# Altium schematic sheet audio.SchDoc: 音频功放
size A4; Author: Todd; DrawnBy: 1234; SheetNumber: 1
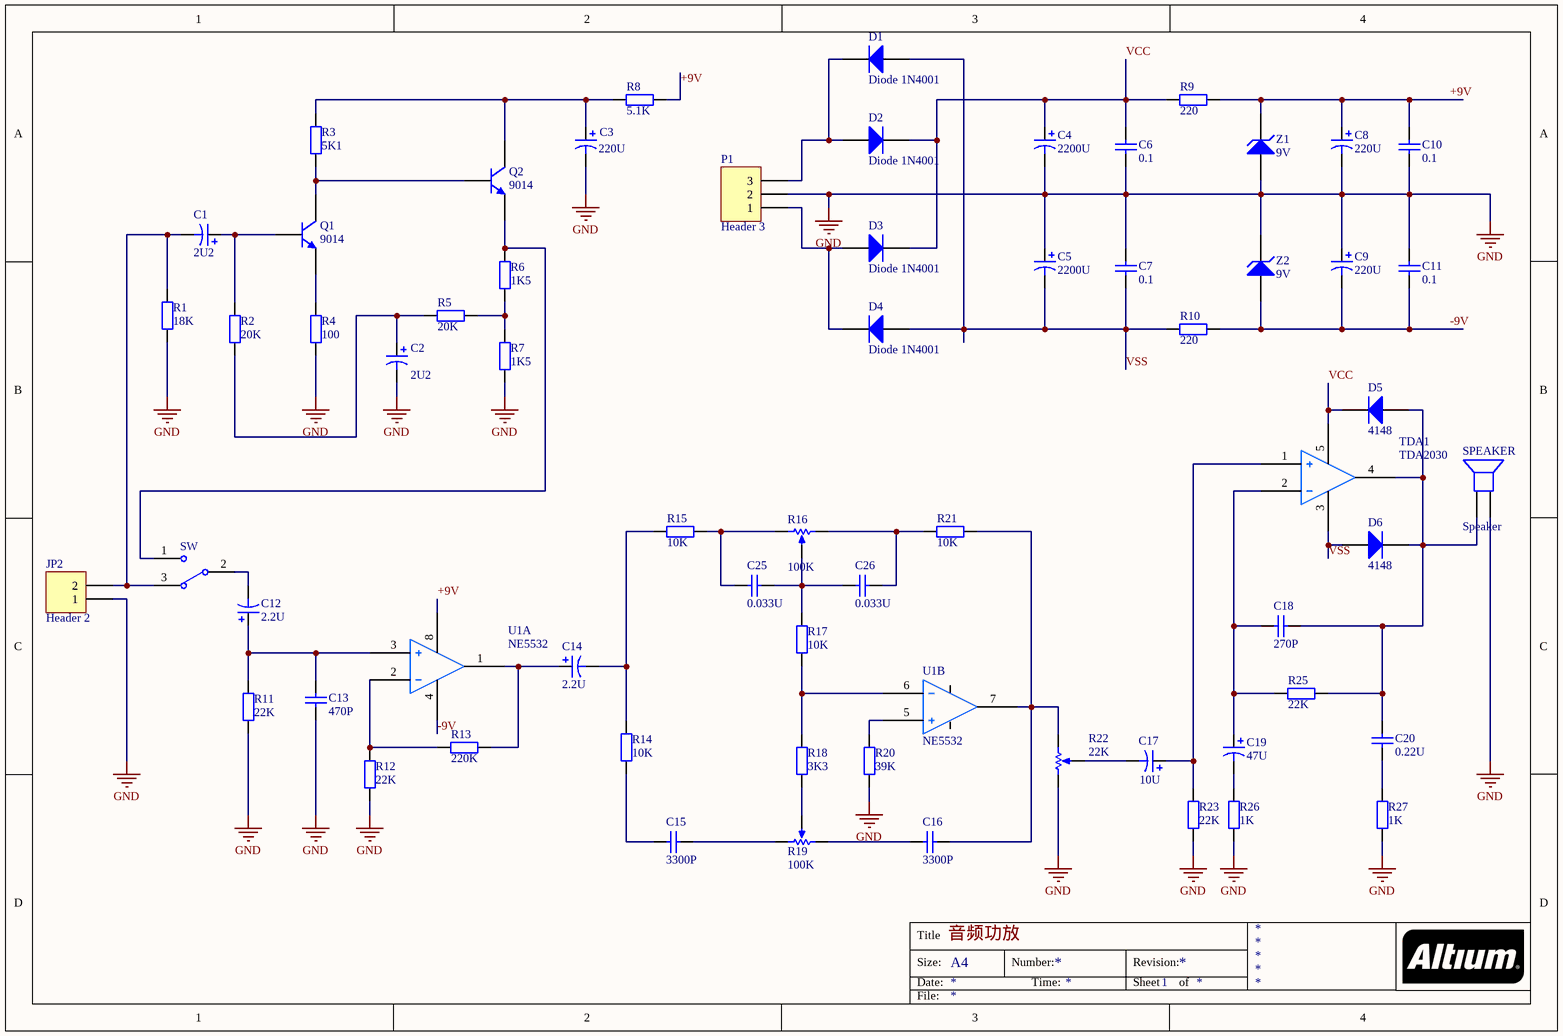
[diagram p0: audio.SchDoc]

## Parts
C1  2U2  [CD0.2]
C2  2U2  [CD0.2]
C3  220U  [CD0.2]
C4  2200U  [CD0.2]
C5  2200U  [CD0.2]
C6  0.1  [C0.2A]
C7  0.1  [C0.2A]
C8  220U  [CD0.2]
C9  220U  [CD0.2]
C10  0.1  [C0.2A]
C11  0.1  [C0.2A]
C12  2.2U  [CD0.2]
C13  470P  [C0.2A]
C14  2.2U  [CD0.2]
C15  3300P  [C0.2A]
C16  3300P  [C0.2A]
C17  10U  [CD0.2]
C18  270P  [C0.2A]
C19  47U  [CD0.2]
C20  0.22U  [C0.2A]
C25  0.033U  [C0.2A]
C26  0.033U  [C0.2A]
D1  Diode 1N4001  [DIODE0.4]
D2  Diode 1N4001  [DIODE0.4]
D3  Diode 1N4001  [DIODE0.4]
D4  Diode 1N4001  [DIODE0.4]
D5  4148  [DIODE0.4]
D6  4148  [DIODE0.4]
JP2  Header 2  [p2]
P1  Header 3  [p3]
Q1  9014  [TO-226-AA]
Q2  9014  [TO-226-AA]
R1  18K  [AXIAL-0.4]
R2  20K  [AXIAL-0.4]
R3  5K1  [AXIAL-0.4]
R4  100  [AXIAL-0.4]
R5  20K  [AXIAL-0.4]
R6  1K5  [AXIAL-0.4]
R7  1K5  [AXIAL-0.4]
R8  5.1K  [AXIAL-0.4]
R9  220  [AXIAL-0.4]
R10  220  [AXIAL-0.4]
R11  22K  [AXIAL-0.4]
R12  22K  [AXIAL-0.4]
R13  220K  [AXIAL-0.4]
R14  10K  [AXIAL-0.4]
R15  10K  [AXIAL-0.4]
R16  100K  [LK01]
R17  10K  [AXIAL-0.4]
R18  3K3  [AXIAL-0.4]
R19  100K  [LK01]
R20  39K  [AXIAL-0.4]
R21  10K  [AXIAL-0.4]
R22  22K  [LK01]
R23  22K  [AXIAL-0.4]
R25  22K  [AXIAL-0.4]
R26  1K  [AXIAL-0.4]
R27  1K  [AXIAL-0.4]
SPEAKER  Speaker  [p2]
SW  SW-SPDT  [SW]  (value not drawn)
TDA1  TDA2030  [7805E]
U1  NE5532  [DIP8]  (parts A,B of 2)
Z1  9V  [DIODE0.4]
Z2  9V  [DIODE0.4]

## Nets
GND: C2.2 C3.2 C4.2 C5.1 C6.1 C7.2 C8.2 C9.1 C10.2 C11.1 C13.1 JP2.1 P1.2 R1.1 R4.1 R7.1 R11.1 R12.1 R20.1 R22.1(TOP) R23.1 R26.1 R27.1 SPEAKER.2 Z1.1(A) Z2.2(K)
+9V: C8.1 C10.1 R8.2 R9.2 U1.8 Z1.2(K)
-9V: C9.2 C11.2 R10.2 U1.4 Z2.1(A)
VCC: C4.1 C6.2 D2.2(K) D3.2(K) D5.2(K) R9.1 TDA1.5
VSS: C5.2 C7.1 D1.1(A) D4.1(A) D6.1(A) R10.1 TDA1.3
NetC1_1: C1.1 Q1.2(B) R2.2
NetC1_2: C1.2 JP2.2 R1.2 SW.3
NetC2_1: C2.1 R2.1 R5.1
NetC3_1: C3.1 Q2.3(C) R3.2 R8.1
NetC12_1: C12.1 C13.2 R11.2 U1.3
NetC12_2: C12.2 SW.2
NetC14_1: C14.1 R13.2 U1.1
NetC14_2: C14.2 R14.2 R15.1
NetC15_1: C15.1 R14.1
NetC15_2: C15.2 R19.2(BOT)
NetC16_1: C16.1 R19.1(TOP)
NetC16_2: C16.2 R21.2 R22.2(BOT) U1.7
NetC17_1: C17.1 R23.2 TDA1.1
NetC17_2: C17.2 R22.3(TAP)
NetC18_1: C18.1 C19.1 R25.1 TDA1.2
NetC18_2: C18.2 C20.2 D5.1(A) D6.2(K) R25.2 SPEAKER.1 TDA1.4
NetC19_2: C19.2 R26.2
NetC20_1: C20.1 R27.2
NetC25_1: C25.1 R15.2 R16.1(TOP)
NetC25_2: C25.2 C26.1 R16.3(TAP) R17.2
NetC26_2: C26.2 R16.2(BOT) R21.1
NetD1_2: D1.2(K) D2.1(A) P1.3
NetD3_1: D3.1(A) D4.2(K) P1.1
NetQ1_1: Q1.1(E) R4.2
NetQ1_3: Q1.3(C) Q2.2(B) R3.1
NetQ2_1: Q2.1(E) R6.2 SW.1
NetR5_2: R5.2 R6.1 R7.2
NetR12_2: R12.2 R13.1 U1.2
NetR17_1: R17.1 R18.2 U1.6
NetR18_1: R18.1 R19.3(TAP)
NetR20_2: R20.2 U1.5

## Notes on the sheet
- Title
- Size:
- Date:
- A4
- Number:
- Time:
- Revision:
- Sheet
- of
- File:

## Library data of the parts
C1-C5 C8 C9 C12 C14 C17 C19 = Cap Pol1: Polarized Capacitor (Radial); Published: 8-Jun-2000; LatestRevisionDate: 17-Jul-2002; LatestRevisionNote: Re-released for DXP Platform.; PackageReference: RB7.6-15; Publisher: Altium Limited
C6 C7 C10 C11 C13 C15 C16 C18 C20 C25 C26 = Cap: Capacitor; Published: 8-Jun-2000; LatestRevisionDate: 17-Jul-2002; LatestRevisionNote: Re-released for DXP Platform.; PackageReference: RAD-0.3; Publisher: Altium Limited
D1-D4 = Diode 1N4001: 1 Amp General Purpose Rectifier; Published: 8-Jun-2000; LatestRevisionDate: 17-Jul-2002; LatestRevisionNote: Re-released for DXP Platform.; DatasheetVersion: 1998; PackageVersion: Aug-1999; PackageReference: DO-41; Publisher: Altium Limited; Code_JEDEC: DO-204-AL; ComponentLink1Description: Manufacturer Link; ComponentLink1URL: http://www.fairchildsemi.com/; ComponentLink2Description: Datasheet; ComponentLink2URL: http://www.fairchildsemi.com/ds/1N%2F1N4001.pdf
D5 D6 = Diode 1N4148: High Conductance Fast Diode; Published: 8-Jun-2000; LatestRevisionDate: 17-Jul-2002; LatestRevisionNote: Re-released for DXP Platform.; DatasheetVersion: 1997; PackageReference: DO-35; Publisher: Altium Limited; Code_JEDEC: DO-204-AH; ComponentLink1Description: Manufacturer Link; ComponentLink1URL: http://www.fairchildsemi.com/; ComponentLink2Description: Datasheet; ComponentLink2URL: http://www.fairchildsemi.com/ds/1N%2F1N4148.pdf
JP2 = Header 2: Header, 2-Pin; LatestRevisionDate: 17-Jul-2002; LatestRevisionNote: Re-released for DXP Platform.; Publisher: Altium Limited
P1 = Header 3: Header, 3-Pin; LatestRevisionDate: 17-Jul-2002; LatestRevisionNote: Re-released for DXP Platform.; Publisher: Altium Limited
Q1 Q2 = 2N3904: NPN General Purpose Amplifier; Published: 8-Jun-2000; LatestRevisionDate: 15-Jan-2003; LatestRevisionNote: PCB Footprint 'BCY-W3/D4.7' replaced; DatasheetVersion: 1997; PackageVersion: Sep-1998; PackageReference: TO-92A; Publisher: Altium Limited; Code_JEDEC: TO-92A; ComponentLink1Description: Manufacturer Link; ComponentLink1URL: http://www.fairchildsemi.com/; ComponentLink2Description: Datasheet; ComponentLink2URL: http://www.fairchildsemi.com/ds/2N%2F2N3904.pdf
R1-R15 R17 R18 R20 R21 R23 R25-R27 = Res2: Resistor; Published: 8-Jun-2000; LatestRevisionDate: 17-Jul-2002; LatestRevisionNote: Re-released for DXP Platform.; PackageReference: AXIAL-0.4; Publisher: Altium Limited
R16 R19 R22 = RPot: Potentiometer; Sim Note: Enter the Resistance value and the set point into parameter fields.; Set Position: 0.5; Published: 8-Jun-2000; LatestRevisionDate: 17-Jul-2002; LatestRevisionNote: Re-released for DXP Platform.; PackageReference: VR5; Publisher: Altium Limited; PackageDescription: Variable Resistor, Thru-Hole; 3 Leads
  R16 R19: Value: 100K
  R22: Value: 22K
SPEAKER = Speaker: Loudspeaker; Published: 24-Mar-1999; LatestRevisionDate: 17-Jul-2002; LatestRevisionNote: Re-released for DXP Platform.; PackageReference: PIN2; Publisher: Altium Limited
SW = SW-SPDT: SPDT Subminiature Toggle Switch, Right Angle Mounting, Vertical Actuation; Published: 24-Mar-1999; LatestRevisionDate: 17-Dec-2003; LatestRevisionNote: Schematic revised, PCB Footprint replaced.; DatasheetVersion: 05-Dec-2000; PackageReference: TL36WW15050; Publisher: Altium Limited; ComponentLink1Description: Manufacturer Link; ComponentLink1URL: http://www.apem.com
Z1 Z2 = D Zener: Zener Diode; Published: 8-Jun-2000; LatestRevisionDate: 17-Jul-2002; LatestRevisionNote: Re-released for DXP Platform.; PackageReference: DIODE-0.7; Publisher: Altium Limited